# Altium schematic sheet Power_Schematics.SchDoc
size A; SheetNumber: 2; SheetTotal: 2
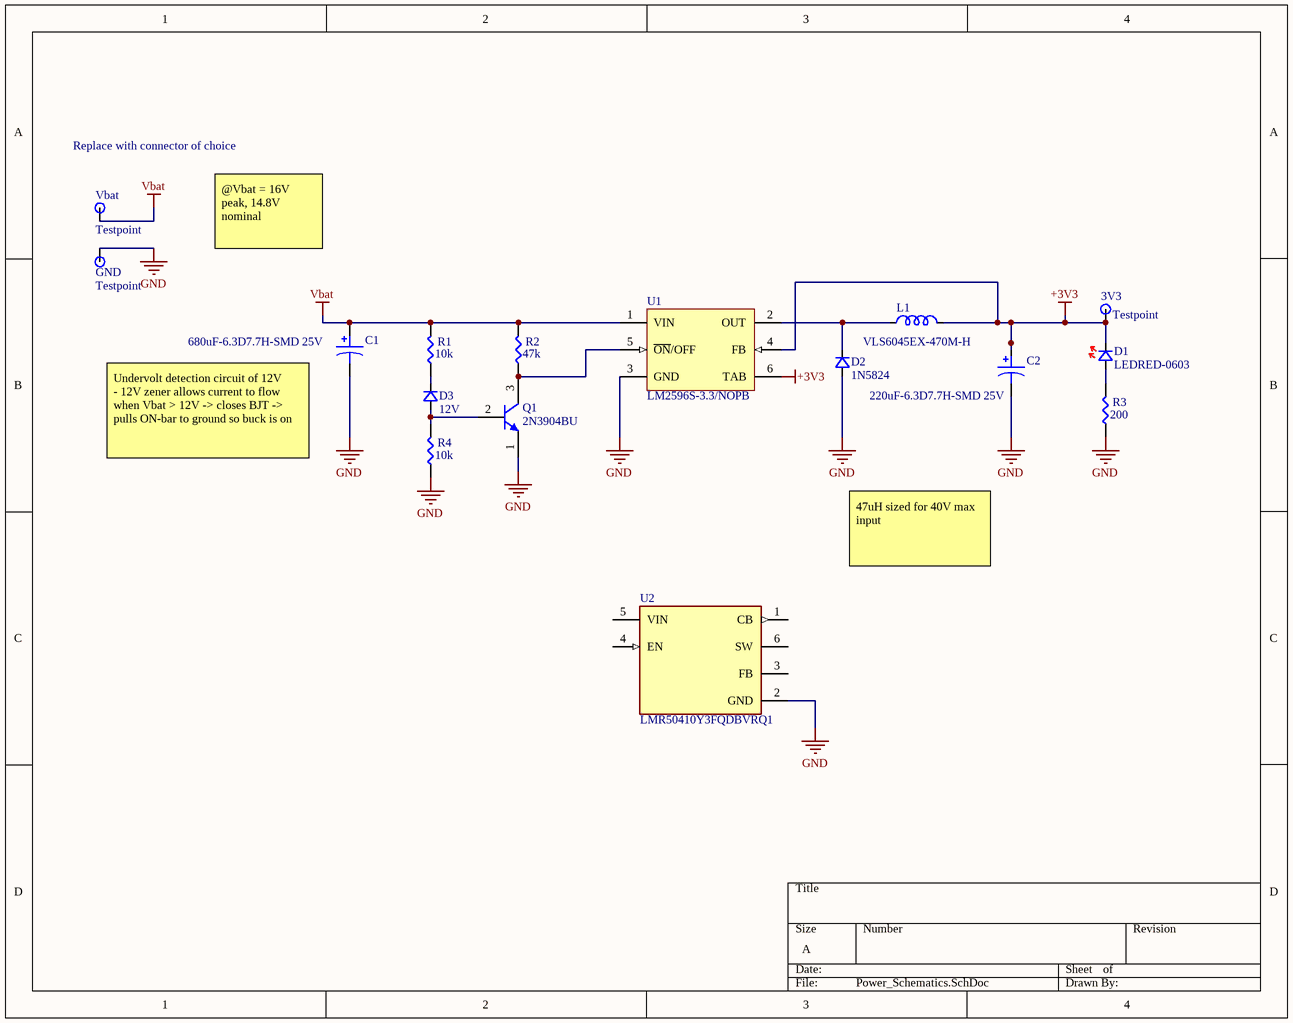
[diagram p0: Power_Schematics.SchDoc]

## Parts
3V3  Testpoint  [Testpoint]
C1  680uF-6.3D7.7H-SMD 25V  [CAP-6.3D7.7H-SMD]
C2  220uF-6.3D7.7H-SMD 25V  [CAP-6.3D7.7H-SMD]
D1  LEDRED-0603  [LEDRED-0603]
D2  1N5824  [DO41-10]
D3  12V  [SOD123]
GND  Testpoint  [Testpoint]
L1  VLS6045EX-470M-H  [IND-6045]
Q1  2N3904BU  [FAIR-TO-92]
R1  10k  [RES-0603]
R2  47k  [RES-0603]
R3  200  [RES-0603]
R4  10k  [RES-0603]
U1  LM2596S-3.3/NOPB  [KTT0005B_M]
U2  LMR50410Y3FQDBVRQ1  [FP-DBV0006A-IPC_B]
Vbat  Testpoint  [Testpoint]

## Nets
+3V3: 3V3.1 C2.POS(+) D1.K L1.2 U1.4(FB) U1.6(TAB)
GND: C1.NEG(-) C2.NEG(-) D2.A GND.1 Q1.1(E) R3.1 R4.1 U1.3(GND) U2.2(GND)
Vbat: C1.POS(+) R1.2 R2.2 U1.1(VIN) Vbat.1
NetD1_A: D1.A R3.2
NetD2_K: D2.K L1.1 U1.2(OUT)
NetD3_A: D3.A Q1.2(B) R4.2
NetD3_K: D3.K R1.1
NetQ1_3: Q1.3(C) R2.1 U1.5(~{ON}/OFF)

Not connected (* = marked no-connect by the designer): U2 1(CB) 3(FB) 4(EN) 5(VIN) 6(SW)

## Notes on the sheet
- Replace with connector of choice
- @Vbat = 16V peak, 14.8V nominal
- (near C1) Undervolt detection circuit of 12V
  - 12V zener allows current to flow when Vbat > 12V -> closes BJT -> pulls ON-bar to ground so buck is on
- 47uH sized for 40V max input

## Library data of the parts
3V3 GND Vbat = CMP-009-000182-1: Design Item ID: Testpoint; Source: ife19_Elec_Library.SchLib
C1 C2 = CMP-050-000094-1: Source: ife19_Elec_Library.SchLib; Design Item ID: CAP-6.3D7.7H-SMD
D1 = CMP-009-000189-1: Design Item ID: LEDRED-0603; Source: ife19_Elec_Library.SchLib
D2 = CMP-010-000010-1: Design Item ID: DIODE-DO41-10; Source: ife19_Elec_Library.SchLib
D3 = CMP-010-000008-1: Design Item ID: DIODE-SOD123; Source: ife19_Elec_Library.SchLib
L1 = CMP-011-000044-1: Design Item ID: IND-6045; Source: ife19_Elec_Library.SchLib
Q1 = CMP-2000-04944-1: NPN General-Purpose Amplifier, 40 V VCEO, 0.2 A, -55 to 150 degC, 2-Pin TO-92, RoHS, Bulk; Manufacturer: FairchildSemiconductor; Maximum Collector Base Voltage: 60V; Minimum DC Current Gain: 40@0.1mA@1V; Maximum Collector Emitter Voltage: 40V; Maximum DC Collector Current: 0.2A; Rad Hard: No; Maximum Operating Frequency: 300(Min)MHz; Maximum Collector Emitter Saturation Voltage: 0.2@1mA@10mA; Maximum Power Dissipation: 625mW; Package Description: 3-Pin Transistor Outline Package, Body Dia 4.79 mm, Pitch 1.27 mm; Package Reference: TO-92; Pin Count: 3; Operating Temperature: -55to150degC; Category: GPBJT; Manufacturer URL: https://www.fairchildsemi.com/; Datasheet URL: https://datasheet.ciiva.com/4722/2n3904-82270-4722369.pdf; Package: 3TO-92; Packaging: Bulk; Type: NPN; Datasheet Version: Rev. 1.1.0, 10/2014; Mounting: ThroughHole
R1-R4 = CMP-014-000032-1: Source: ife19_Elec_Library.SchLib; Design Item ID: RES-0603
U1 = CMP-0069-00275-3: SIMPLE SWITCHER® Power Converter 150 KHz 3A Step-Down Voltage Regulator, 5-pin TO-263, Pb-Free; Manufacturer: Texas Instruments; PackageTopMarking: NSUZXYTTE#*LM2596S*-3.3 P+; PowerWise: N; RoHS: Y; PackageReference: KTT0005B; PackageDescription: TO-263, Molded, .400 x .390 x .180in, 5 Lead, .067in Pitch, Surface Mount; PinCount: 5; ComponentLink1Description: Datasheet URL; Code_JEDEC: MO-169-AB; ComponentLink1URL: http://www.ti.com/general/docs/lit/getliterature.tsp?genericPartNumber=LM2596&fileType=pdf; CompType: Switcher
U2 = CMP-053-000230-1: Switching Regulator, Current-mode, 1A, 2100kHz Switching Freq-Max, PDSO6; ComponentLink5Description: http://www.ti.com/general/docs/lit/getliterature.tsp?genericPartNumber=SN74LVC1G08&&fileType=pdf&src-supplier=Avnet; ComponentLink1Description: http://focus.ti.com/lit/ds/symlink/sn74lvc1g08.pdf?src-supplier=Avnet+Europe; ComponentLink8Description: https://www.verical.com/server-webapp/html/getDatasheet?partID=39173&src-supplier=Verical; ComponentLink6Description: http://www.ti.com/general/docs/lit/getliterature.tsp?genericPartNumber=SN74LVC1G08&amp;&amp;fileType=pdf&src-supplier=Avnet+Asia; ComponentLink4Description: http://www.produktinfo.conrad.com/datenblaetter/1000000-1099999/001074511-da-01-en-IC_2_INPUT_SN74LVC1G08DBVR_SOT_23_5_TID.pdf?src-supplier=Conrad; ComponentLink7Description: http://www.ti.com/lit/pdf/sdyu001?src-supplier=Digi-Key; ComponentLink2Description: http://www.farnell.com/datasheets/1996458.pdf?src-supplier=Element14; ComponentLink3Description: http://www.jameco.com/Jameco/Products/ProdDS/756490.pdf?src-supplier=Jameco